# EAGLE schematic FMCtoEdgeLS_R (EAGLE 9.6.2)
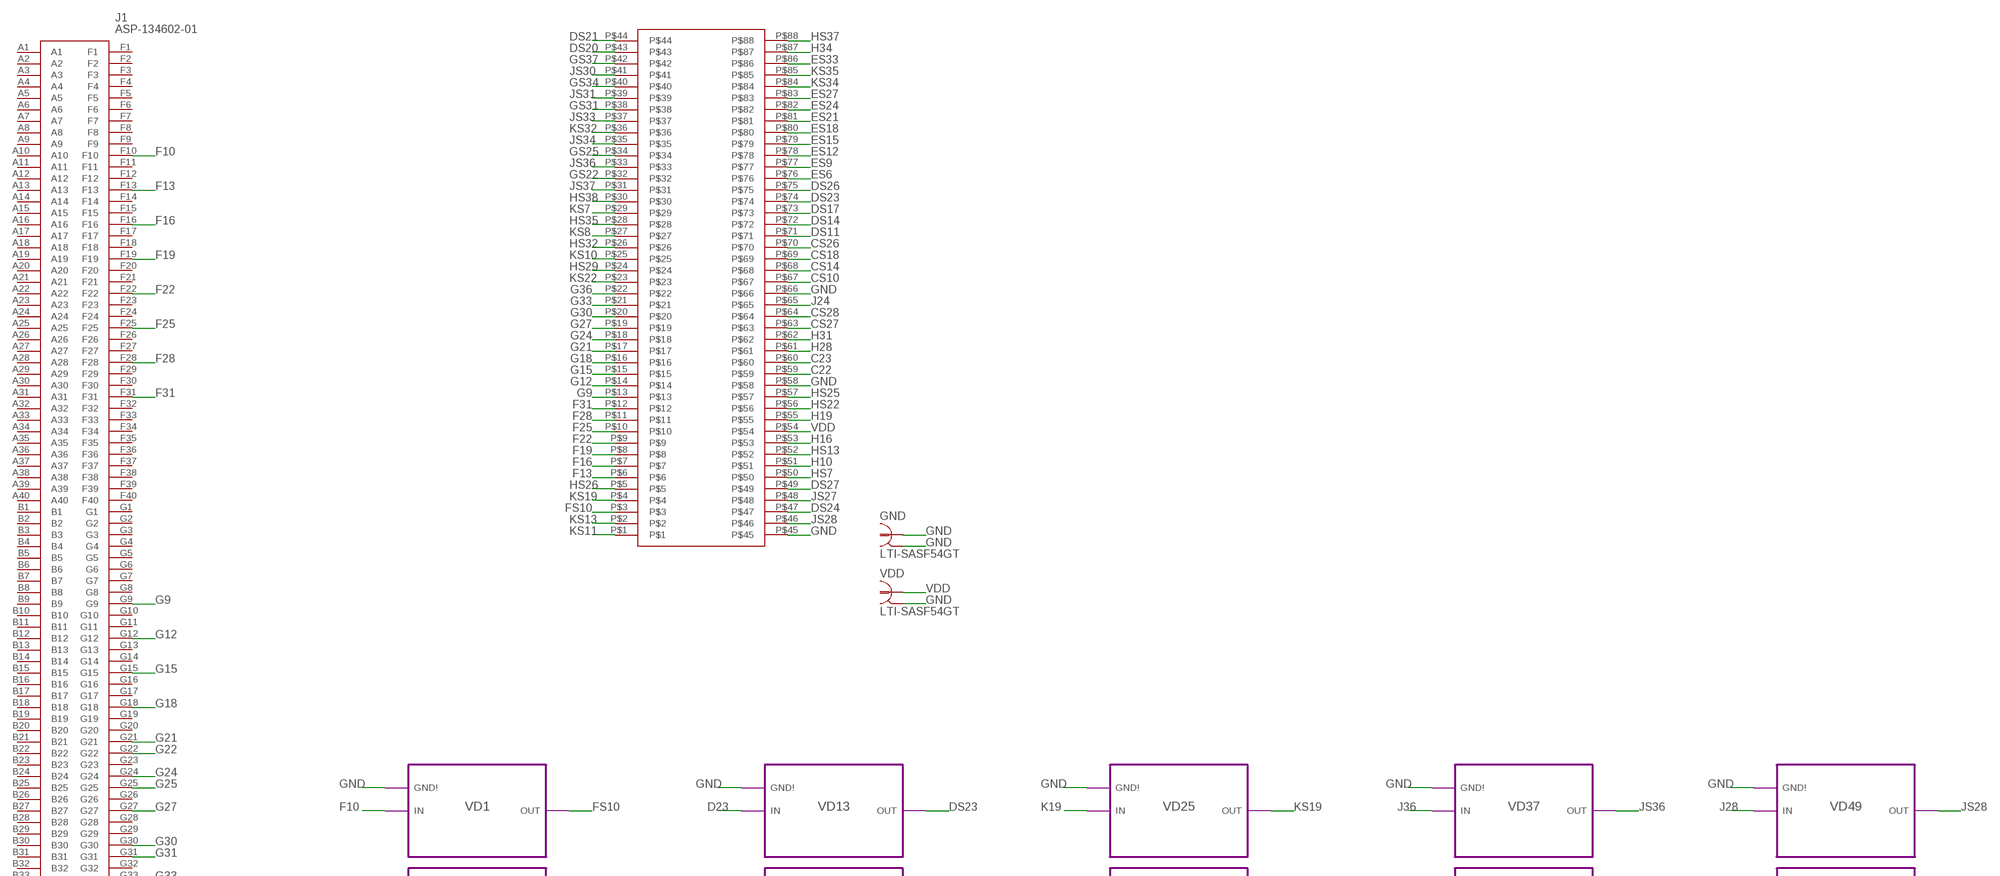
[diagram p0: schematic, sheet 1, part 1 of 2]
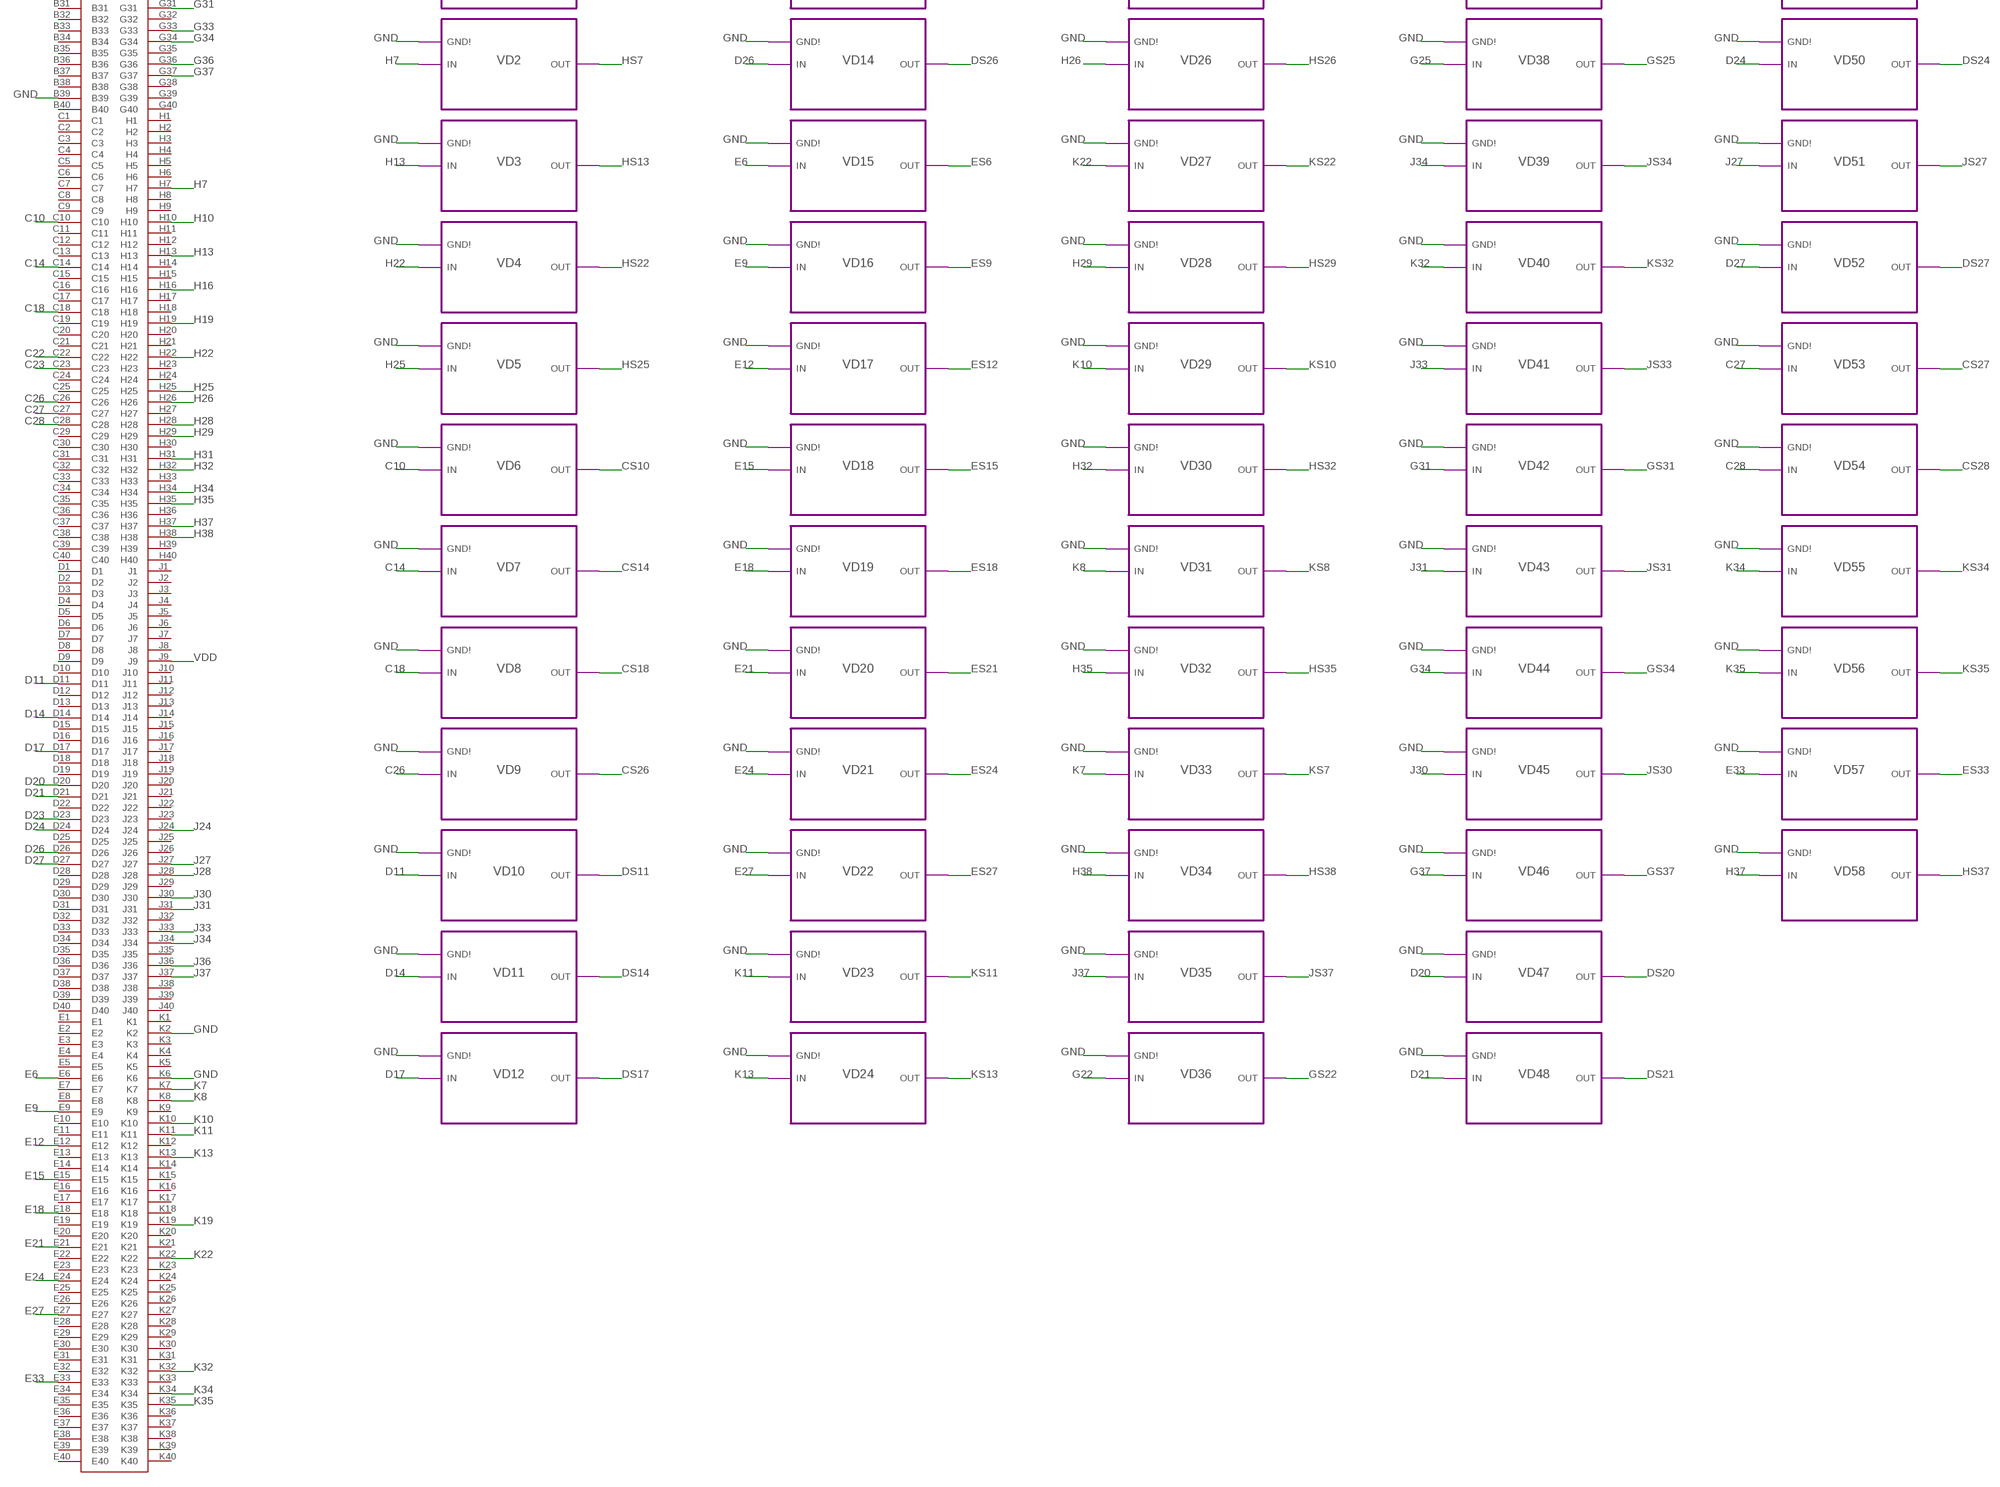
[diagram p1: schematic, sheet 1, part 2 of 2]

## Parts
GND  LTI-SASF54GT  [LTI-SASF54GT]
J1  ASP-134602-01  [ASP13460201]
U$1  EDGEPADS(THRU)  [EDGEPADS(THRU)]
VDD  LTI-SASF54GT  [LTI-SASF54GT]

## Module instances
VD1 = VOLTAGEDIVIDER
VD2 = VOLTAGEDIVIDER
VD3 = VOLTAGEDIVIDER
VD4 = VOLTAGEDIVIDER
VD5 = VOLTAGEDIVIDER
VD6 = VOLTAGEDIVIDER
VD7 = VOLTAGEDIVIDER
VD8 = VOLTAGEDIVIDER
VD9 = VOLTAGEDIVIDER
VD10 = VOLTAGEDIVIDER
VD11 = VOLTAGEDIVIDER
VD12 = VOLTAGEDIVIDER
VD13 = VOLTAGEDIVIDER
VD14 = VOLTAGEDIVIDER
VD15 = VOLTAGEDIVIDER
VD16 = VOLTAGEDIVIDER
VD17 = VOLTAGEDIVIDER
VD18 = VOLTAGEDIVIDER
VD19 = VOLTAGEDIVIDER
VD20 = VOLTAGEDIVIDER
VD21 = VOLTAGEDIVIDER
VD22 = VOLTAGEDIVIDER
VD23 = VOLTAGEDIVIDER
VD24 = VOLTAGEDIVIDER
VD25 = VOLTAGEDIVIDER
VD26 = VOLTAGEDIVIDER
VD27 = VOLTAGEDIVIDER
VD28 = VOLTAGEDIVIDER
VD29 = VOLTAGEDIVIDER
VD30 = VOLTAGEDIVIDER
VD31 = VOLTAGEDIVIDER
VD32 = VOLTAGEDIVIDER
VD33 = VOLTAGEDIVIDER
VD34 = VOLTAGEDIVIDER
VD35 = VOLTAGEDIVIDER
VD36 = VOLTAGEDIVIDER
VD37 = VOLTAGEDIVIDER
VD38 = VOLTAGEDIVIDER
VD39 = VOLTAGEDIVIDER
VD40 = VOLTAGEDIVIDER
VD41 = VOLTAGEDIVIDER
VD42 = VOLTAGEDIVIDER
VD43 = VOLTAGEDIVIDER
VD44 = VOLTAGEDIVIDER
VD45 = VOLTAGEDIVIDER
VD46 = VOLTAGEDIVIDER
VD47 = VOLTAGEDIVIDER
VD48 = VOLTAGEDIVIDER
VD49 = VOLTAGEDIVIDER
VD50 = VOLTAGEDIVIDER
VD51 = VOLTAGEDIVIDER
VD52 = VOLTAGEDIVIDER
VD53 = VOLTAGEDIVIDER
VD54 = VOLTAGEDIVIDER
VD55 = VOLTAGEDIVIDER
VD56 = VOLTAGEDIVIDER
VD57 = VOLTAGEDIVIDER
VD58 = VOLTAGEDIVIDER

## Nets
C10: J1.C10 ; port VD6.IN
C14: J1.C14 ; port VD7.IN
C18: J1.C18 ; port VD8.IN
C22: J1.C22 U$1.P$59
C23: J1.C23 U$1.P$60
C26: J1.C26 ; port VD9.IN
C27: J1.C27 ; port VD53.IN
C28: J1.C28 ; port VD54.IN
CS10: U$1.P$67 ; port VD6.OUT
CS14: U$1.P$68 ; port VD7.OUT
CS18: U$1.P$69 ; port VD8.OUT
CS26: U$1.P$70 ; port VD9.OUT
CS27: U$1.P$63 ; port VD53.OUT
CS28: U$1.P$64 ; port VD54.OUT
D11: J1.D11 ; port VD10.IN
D14: J1.D14 ; port VD11.IN
D17: J1.D17 ; port VD12.IN
D20: J1.D20 ; port VD47.IN
D21: J1.D21 ; port VD48.IN
D23: J1.D23 ; port VD13.IN
D24: J1.D24 ; port VD50.IN
D26: J1.D26 ; port VD14.IN
D27: J1.D27 ; port VD52.IN
DS11: U$1.P$71 ; port VD10.OUT
DS14: U$1.P$72 ; port VD11.OUT
DS17: U$1.P$73 ; port VD12.OUT
DS20: U$1.P$43 ; port VD47.OUT
DS21: U$1.P$44 ; port VD48.OUT
DS23: U$1.P$74 ; port VD13.OUT
DS24: U$1.P$47 ; port VD50.OUT
DS26: U$1.P$75 ; port VD14.OUT
DS27: U$1.P$49 ; port VD52.OUT
E6: J1.E6 ; port VD15.IN
E9: J1.E9 ; port VD16.IN
E12: J1.E12 ; port VD17.IN
E15: J1.E15 ; port VD18.IN
E18: J1.E18 ; port VD19.IN
E21: J1.E21 ; port VD20.IN
E24: J1.E24 ; port VD21.IN
E27: J1.E27 ; port VD22.IN
E33: J1.E33 ; port VD57.IN
ES6: U$1.P$76 ; port VD15.OUT
ES9: U$1.P$77 ; port VD16.OUT
ES12: U$1.P$78 ; port VD17.OUT
ES15: U$1.P$79 ; port VD18.OUT
ES18: U$1.P$80 ; port VD19.OUT
ES21: U$1.P$81 ; port VD20.OUT
ES24: U$1.P$82 ; port VD21.OUT
ES27: U$1.P$83 ; port VD22.OUT
ES33: U$1.P$86 ; port VD57.OUT
F10: J1.F10 ; port VD1.IN
F13: J1.F13 U$1.P$6
F16: J1.F16 U$1.P$7
F19: J1.F19 U$1.P$8
F22: J1.F22 U$1.P$9
F25: J1.F25 U$1.P$10
F28: J1.F28 U$1.P$11
F31: J1.F31 U$1.P$12
FS10: U$1.P$3 ; port VD1.OUT
G9: J1.G9 U$1.P$13
G12: J1.G12 U$1.P$14
G15: J1.G15 U$1.P$15
G18: J1.G18 U$1.P$16
G21: J1.G21 U$1.P$17
G22: J1.G22 ; port VD36.IN
G24: J1.G24 U$1.P$18
G25: J1.G25 ; port VD38.IN
G27: J1.G27 U$1.P$19
G30: J1.G30 U$1.P$20
G31: J1.G31 ; port VD42.IN
G33: J1.G33 U$1.P$21
G34: J1.G34 ; port VD44.IN
G36: J1.G36 U$1.P$22
G37: J1.G37 ; port VD46.IN
GND: GND.1 GND.2 GND.3 GND.4 GND.5 J1.B39 J1.K2 J1.K6 U$1.P$45 U$1.P$58 U$1.P$66 VDD.2 VDD.3 VDD.4 VDD.5 ; port VD1.GND! VD2.GND! VD22.GND! VD21.GND! VD20.GND! VD19.GND! VD18.GND! VD17.GND! VD16.GND! VD15.GND! VD14.GND! VD13.GND! VD12.GND! VD11.GND! VD10.GND! VD9.GND! VD8.GND! VD7.GND! VD6.GND! VD5.GND! VD4.GND! VD3.GND! VD23.GND! VD24.GND! VD25.GND! VD26.GND! VD27.GND! VD28.GND! VD29.GND! VD30.GND! VD31.GND! VD32.GND! VD33.GND! VD34.GND! VD35.GND! VD36.GND! VD37.GND! VD38.GND! VD39.GND! VD40.GND! VD41.GND! VD42.GND! VD43.GND! VD44.GND! VD45.GND! VD46.GND! VD47.GND! VD48.GND! VD49.GND! VD50.GND! VD51.GND! VD52.GND! VD53.GND! VD54.GND! VD55.GND! VD56.GND! VD57.GND! VD58.GND!
GS22: U$1.P$32 ; port VD36.OUT
GS25: U$1.P$34 ; port VD38.OUT
GS31: U$1.P$38 ; port VD42.OUT
GS34: U$1.P$40 ; port VD44.OUT
GS37: U$1.P$42 ; port VD46.OUT
H7: J1.H7 ; port VD2.IN
H10: J1.H10 U$1.P$51
H13: J1.H13 ; port VD3.IN
H16: J1.H16 U$1.P$53
H19: J1.H19 U$1.P$55
H22: J1.H22 ; port VD4.IN
H25: J1.H25 ; port VD5.IN
H26: J1.H26 ; port VD26.IN
H28: J1.H28 U$1.P$61
H29: J1.H29 ; port VD28.IN
H31: J1.H31 U$1.P$62
H32: J1.H32 ; port VD30.IN
H34: J1.H34 U$1.P$87
H35: J1.H35 ; port VD32.IN
H37: J1.H37 ; port VD58.IN
H38: J1.H38 ; port VD34.IN
HS7: U$1.P$50 ; port VD2.OUT
HS13: U$1.P$52 ; port VD3.OUT
HS22: U$1.P$56 ; port VD4.OUT
HS25: U$1.P$57 ; port VD5.OUT
HS26: U$1.P$5 ; port VD26.OUT
HS29: U$1.P$24 ; port VD28.OUT
HS32: U$1.P$26 ; port VD30.OUT
HS35: U$1.P$28 ; port VD32.OUT
HS37: U$1.P$88 ; port VD58.OUT
HS38: U$1.P$30 ; port VD34.OUT
J24: J1.J24 U$1.P$65
J27: J1.J27 ; port VD51.IN
J28: J1.J28 ; port VD49.IN
J30: J1.J30 ; port VD45.IN
J31: J1.J31 ; port VD43.IN
J33: J1.J33 ; port VD41.IN
J34: J1.J34 ; port VD39.IN
J36: J1.J36 ; port VD37.IN
J37: J1.J37 ; port VD35.IN
JS27: U$1.P$48 ; port VD51.OUT
JS28: U$1.P$46 ; port VD49.OUT
JS30: U$1.P$41 ; port VD45.OUT
JS31: U$1.P$39 ; port VD43.OUT
JS33: U$1.P$37 ; port VD41.OUT
JS34: U$1.P$35 ; port VD39.OUT
JS36: U$1.P$33 ; port VD37.OUT
JS37: U$1.P$31 ; port VD35.OUT
K7: J1.K7 ; port VD33.IN
K8: J1.K8 ; port VD31.IN
K10: J1.K10 ; port VD29.IN
K11: J1.K11 ; port VD23.IN
K13: J1.K13 ; port VD24.IN
K19: J1.K19 ; port VD25.IN
K22: J1.K22 ; port VD27.IN
K32: J1.K32 ; port VD40.IN
K34: J1.K34 ; port VD55.IN
K35: J1.K35 ; port VD56.IN
KS7: U$1.P$29 ; port VD33.OUT
KS8: U$1.P$27 ; port VD31.OUT
KS10: U$1.P$25 ; port VD29.OUT
KS11: U$1.P$1 ; port VD23.OUT
KS13: U$1.P$2 ; port VD24.OUT
KS19: U$1.P$4 ; port VD25.OUT
KS22: U$1.P$23 ; port VD27.OUT
KS32: U$1.P$36 ; port VD40.OUT
KS34: U$1.P$84 ; port VD55.OUT
KS35: U$1.P$85 ; port VD56.OUT
VDD: J1.J9 U$1.P$54 VDD.1
Unconnected: J1.A1 J1.A2 J1.A3 J1.A4 J1.A5 J1.A6 J1.A7 J1.A8 J1.A9 J1.A10 J1.A11 J1.A12 J1.A13 J1.A14 J1.A15 J1.A16 J1.A17 J1.A18 J1.A19 J1.A20 J1.A21 J1.A22 J1.A23 J1.A24 J1.A25 J1.A26 J1.A27 J1.A28 J1.A29 J1.A30 J1.A31 J1.A32 J1.A33 J1.A34 J1.A35 J1.A36 J1.A37 J1.A38 J1.A39 J1.A40 J1.B1 J1.B2 J1.B3 J1.B4 J1.B5 J1.B6 J1.B7 J1.B8 J1.B9 J1.B10 J1.B11 J1.B12 J1.B13 J1.B14 J1.B15 J1.B16 J1.B17 J1.B18 J1.B19 J1.B20 J1.B21 J1.B22 J1.B23 J1.B24 J1.B25 J1.B26 J1.B27 J1.B28 J1.B29 J1.B30 J1.B31 J1.B32 J1.B33 J1.B34 J1.B35 J1.B36 J1.B37 J1.B38 J1.B40 J1.C1 J1.C2 J1.C3 J1.C4 J1.C5 J1.C6 J1.C7 J1.C8 J1.C9 J1.C11 J1.C12 J1.C13 J1.C15 J1.C16 J1.C17 J1.C19 J1.C20 J1.C21 J1.C24 J1.C25 J1.C29 J1.C30 J1.C31 J1.C32 J1.C33 J1.C34 J1.C35 J1.C36 J1.C37 J1.C38 J1.C39 J1.C40 J1.D1 J1.D2 J1.D3 J1.D4 J1.D5 J1.D6 J1.D7 J1.D8 J1.D9 J1.D10 J1.D12 J1.D13 J1.D15 J1.D16 J1.D18 J1.D19 J1.D22 J1.D25 J1.D28 J1.D29 J1.D30 J1.D31 J1.D32 J1.D33 J1.D34 J1.D35 J1.D36 J1.D37 J1.D38 J1.D39 J1.D40 J1.E1 J1.E2 J1.E3 J1.E4 J1.E5 J1.E7 J1.E8 J1.E10 J1.E11 J1.E13 J1.E14 J1.E16 J1.E17 J1.E19 J1.E20 J1.E22 J1.E23 J1.E25 J1.E26 J1.E28 J1.E29 J1.E30 J1.E31 J1.E32 J1.E34 J1.E35 J1.E36 J1.E37 J1.E38 J1.E39 J1.E40 J1.F1 J1.F2 J1.F3 J1.F4 J1.F5 J1.F6 J1.F7 J1.F8 J1.F9 J1.F11 J1.F12 J1.F14 J1.F15 J1.F17 J1.F18 J1.F20 J1.F21 J1.F23 J1.F24 J1.F26 J1.F27 J1.F29 J1.F30 J1.F32 J1.F33 J1.F34 J1.F35 J1.F36 J1.F37 J1.F38 J1.F39 J1.F40 J1.G1 J1.G2 J1.G3 J1.G4 J1.G5 J1.G6 J1.G7 J1.G8 J1.G10 J1.G11 J1.G13 J1.G14 J1.G16 J1.G17 J1.G19 J1.G20 J1.G23 J1.G26 J1.G28 J1.G29 J1.G32 J1.G35 J1.G38 J1.G39 J1.G40 J1.H1 J1.H2 J1.H3 J1.H4 J1.H5 J1.H6 J1.H8 J1.H9 J1.H11 J1.H12 J1.H14 J1.H15 J1.H17 J1.H18 J1.H20 J1.H21 J1.H23 J1.H24 J1.H27 J1.H30 J1.H33 J1.H36 J1.H39 J1.H40 J1.J1 J1.J2 J1.J3 J1.J4 J1.J5 J1.J6 J1.J7 J1.J8 J1.J10 J1.J11 J1.J12 J1.J13 J1.J14 J1.J15 J1.J16 J1.J17 J1.J18 J1.J19 J1.J20 J1.J21 J1.J22 J1.J23 J1.J25 J1.J26 J1.J29 J1.J32 J1.J35 J1.J38 J1.J39 J1.J40 J1.K1 J1.K3 J1.K4 J1.K5 J1.K9 J1.K12 J1.K14 J1.K15 J1.K16 J1.K17 J1.K18 J1.K20 J1.K21 J1.K23 J1.K24 J1.K25 J1.K26 J1.K27 J1.K28 J1.K29 J1.K30 J1.K31 J1.K33 J1.K36 J1.K37 J1.K38 J1.K39 J1.K40

## Library data of the parts
GND VDD = con-coax:LTI-SASF54GT: SMA vertical PCB thrue hole jack Source: Lighthorse Technologies, inc. SASF54GT.pdf; OC_FARNELL: unknown; OC_NEWARK: unknown
J1 = ASP-134602-01:ASP-134602-01: Samtec ASP Series 1.27mm Pitch 400 Way 10 Row PCB Socket, Through Hole, Solder Termination Source: Datasheet <https://componentsearchengine.com/Datasheets/2/ASP-134602-01.pdf>; DESCRIPTION: Samtec ASP Series 1.27mm Pitch 400 Way 10 Row PCB Socket, Through Hole, Solder Termination; HEIGHT: 5.74mm; MANUFACTURER_NAME: SAMTEC; MANUFACTURER_PART_NUMBER: ASP-134602-01; MOUSER_PART_NUMBER: 200-ASP-134602-01; MOUSER_PRICE-STOCK: https://www.mouser.co.uk/ProductDetail/Samtec/ASP-134602-01?qs=FESYatJ8odJXL2em%252Bh4I4Q%3D%3D
U$1 = EdgePads:EDGEPADS(THRU)

## Module VOLTAGEDIVIDER
Ports: IN(io) OUT(io) GND!(pwr)
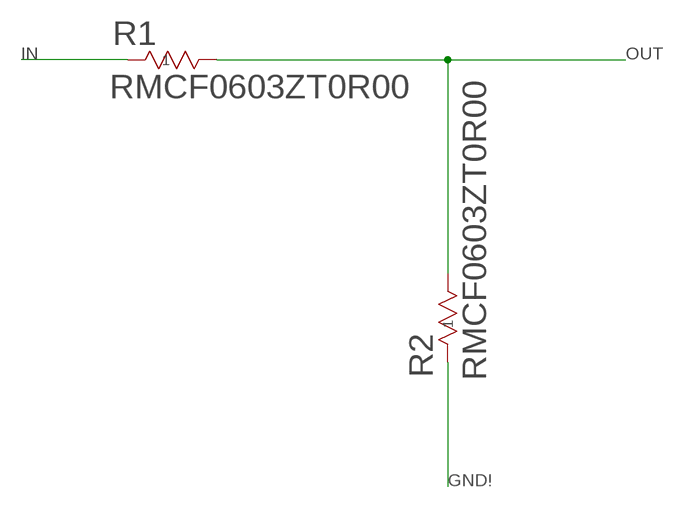
[diagram p2: schematic, module VOLTAGEDIVIDER, sheet 1]

### Parts
R1  RMCF0603ZT0R00  [STA_RMCF0603_STP]
R2  RMCF0603ZT0R00  [STA_RMCF0603_STP]

### Nets
GND!: R2.1
IN: R1.1
OUT: R1.2 R2.2

### Library data of the parts
R1 R2 = SMDResistor:RMCF0603ZT0R00; COPYRIGHT: Copyright (C) 2022 Ultra Librarian. All rights reserved.; DIGI-KEY_PART_NUMBER_1: RMCF0603ZT0R00CT-ND; DIGI-KEY_PART_NUMBER_2: RMCF0603ZT0R00DKR-ND; DIGI-KEY_PART_NUMBER_3: RMCF0603ZT0R00TR-ND; DIGI-KEY_PART_NUMBER_4: RMCF0603ZT0R00TR-NDL; MANUFACTURER_PART_NUMBER: RMCF0603ZT0R00; MFR_NAME: Stackpole International